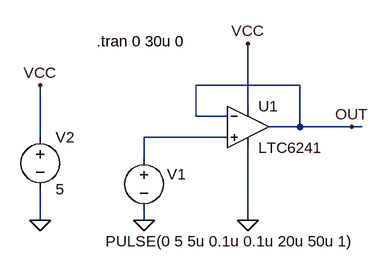
[diagram p0: schematic OpAmp_SlewRate.asc]
OpAmp_SlewRate.asc, the LTspice schematic file:
Version 4
SHEET 1 880 680
WIRE 288 112 128 112
WIRE 208 144 208 48
WIRE 128 160 128 112
WIRE 176 160 128 160
WIRE 288 176 288 112
WIRE 288 176 240 176
WIRE 368 176 288 176
WIRE 384 176 368 176
WIRE -112 192 -112 112
WIRE 176 192 48 192
WIRE 48 224 48 192
WIRE -112 320 -112 272
WIRE 48 320 48 304
WIRE 208 320 208 208
FLAG 208 320 0
FLAG 48 320 0
FLAG -112 320 0
FLAG -112 112 VCC
FLAG 208 48 VCC
FLAG 368 176 OUT
SYMBOL Opamps\\LTC6241 208 176 R0
SYMATTR InstName U1
SYMBOL voltage 48 208 R0
WINDOW 0 35 41 Left 2
WINDOW 3 -59 144 Left 2
WINDOW 123 26 92 Left 2
WINDOW 39 0 0 Left 2
SYMATTR InstName V1
SYMATTR Value PULSE(0 5 5u 0.1u 0.1u 20u 50u 1)
SYMBOL voltage -112 176 R0
WINDOW 123 0 0 Left 2
WINDOW 39 0 0 Left 2
SYMATTR InstName V2
SYMATTR Value 5
TEXT -25 44 Left 2 !.tran 0 30u 0

The netlist it stands for:
* OpAmp_SlewRate.asc
XU1 N001 OUT VCC 0 OUT LTC6241  ; pins In+ In- V+ V- OUT
V1 N001 0 PULSE(0 5 5u 0.1u 0.1u 20u 50u 1)
V2 VCC 0 5
.tran 0 30u 0
.lib LTC4.lib
.backanno
.end